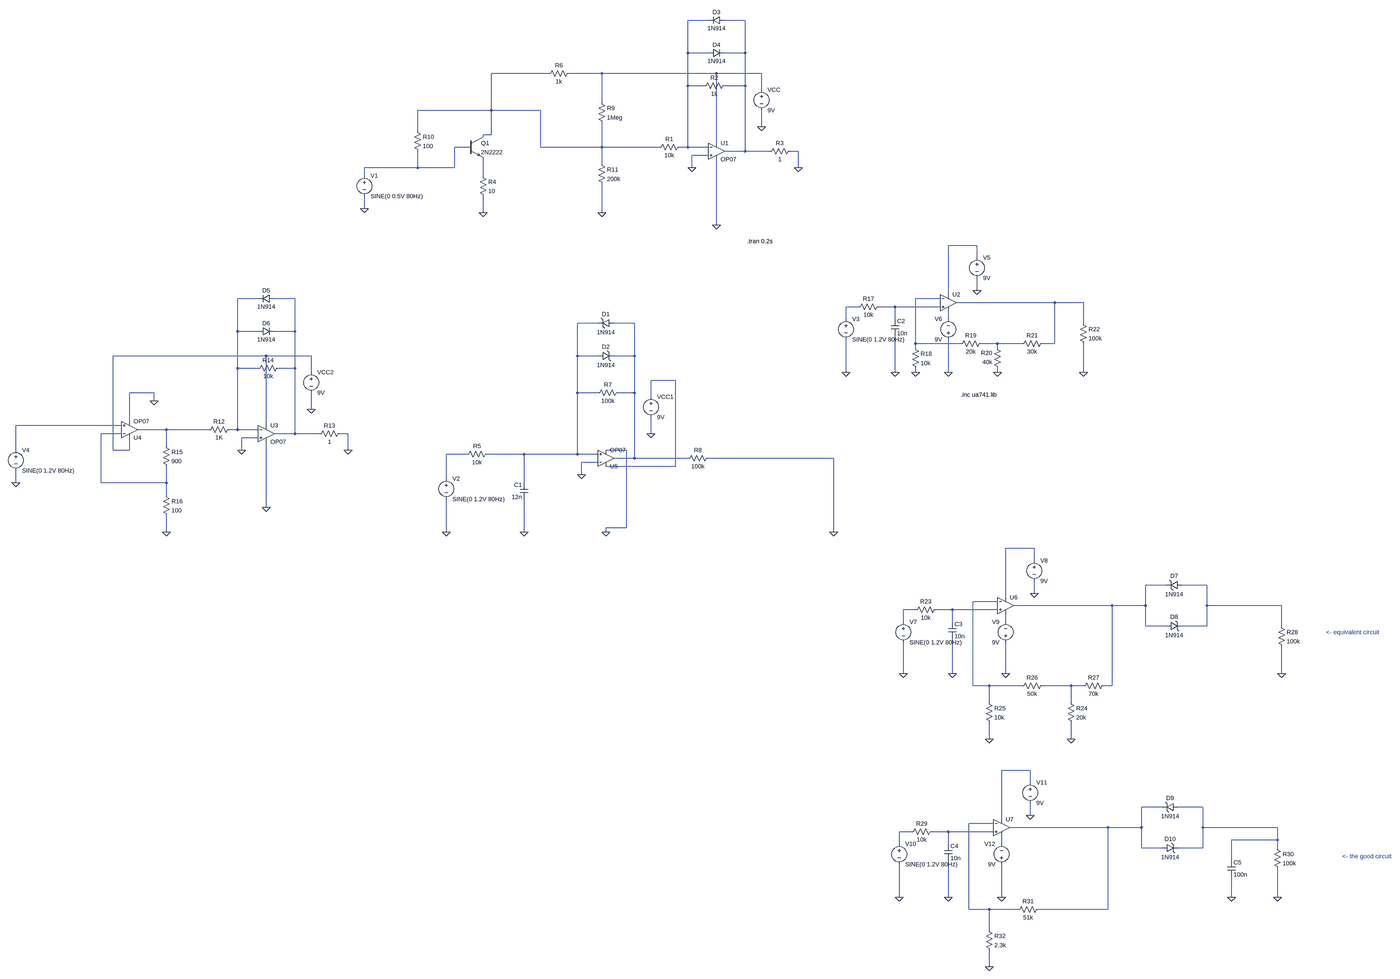
[diagram p0: schematic triggerSchmittFuzz-trialAndError.asc, whole sheet]
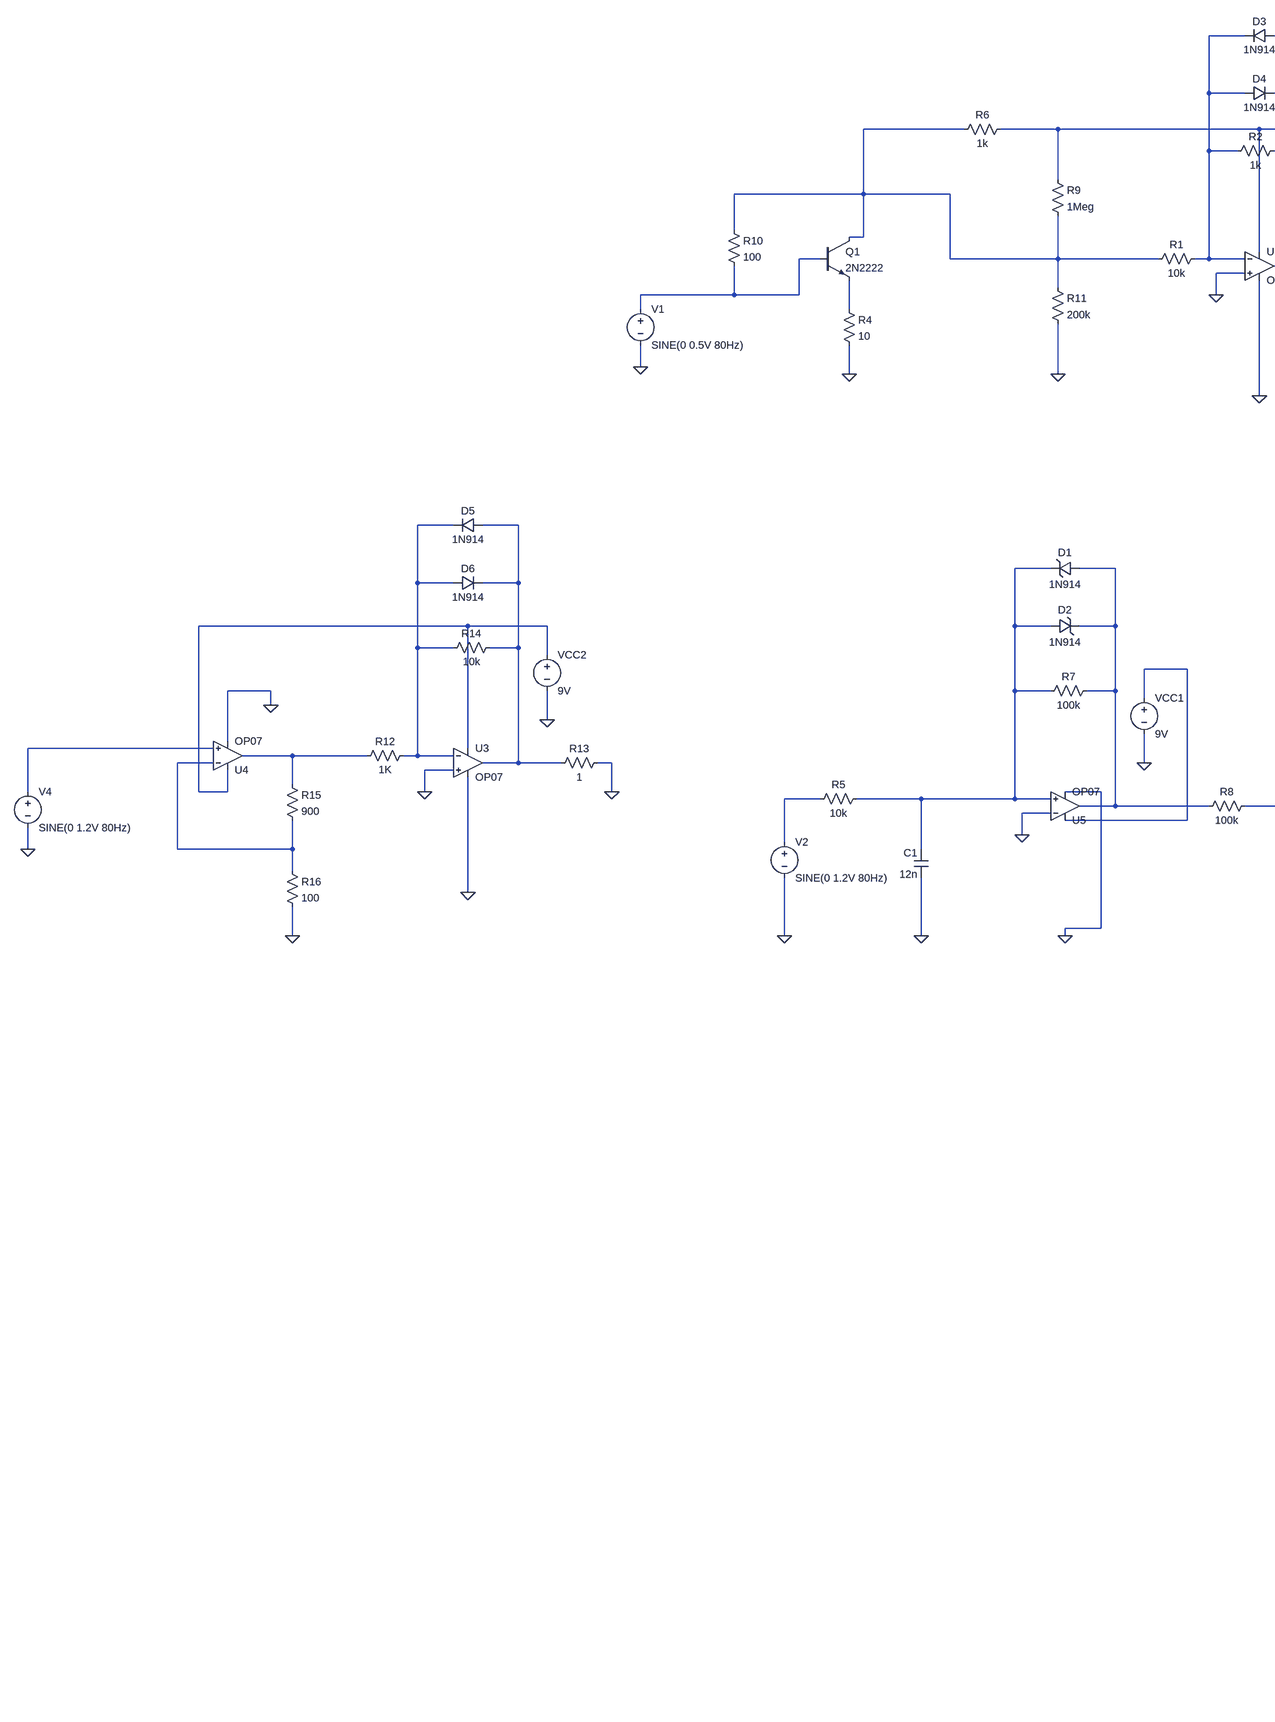
[diagram p1: schematic triggerSchmittFuzz-trialAndError.asc, part, row 1 of 1, column 1 of 2]
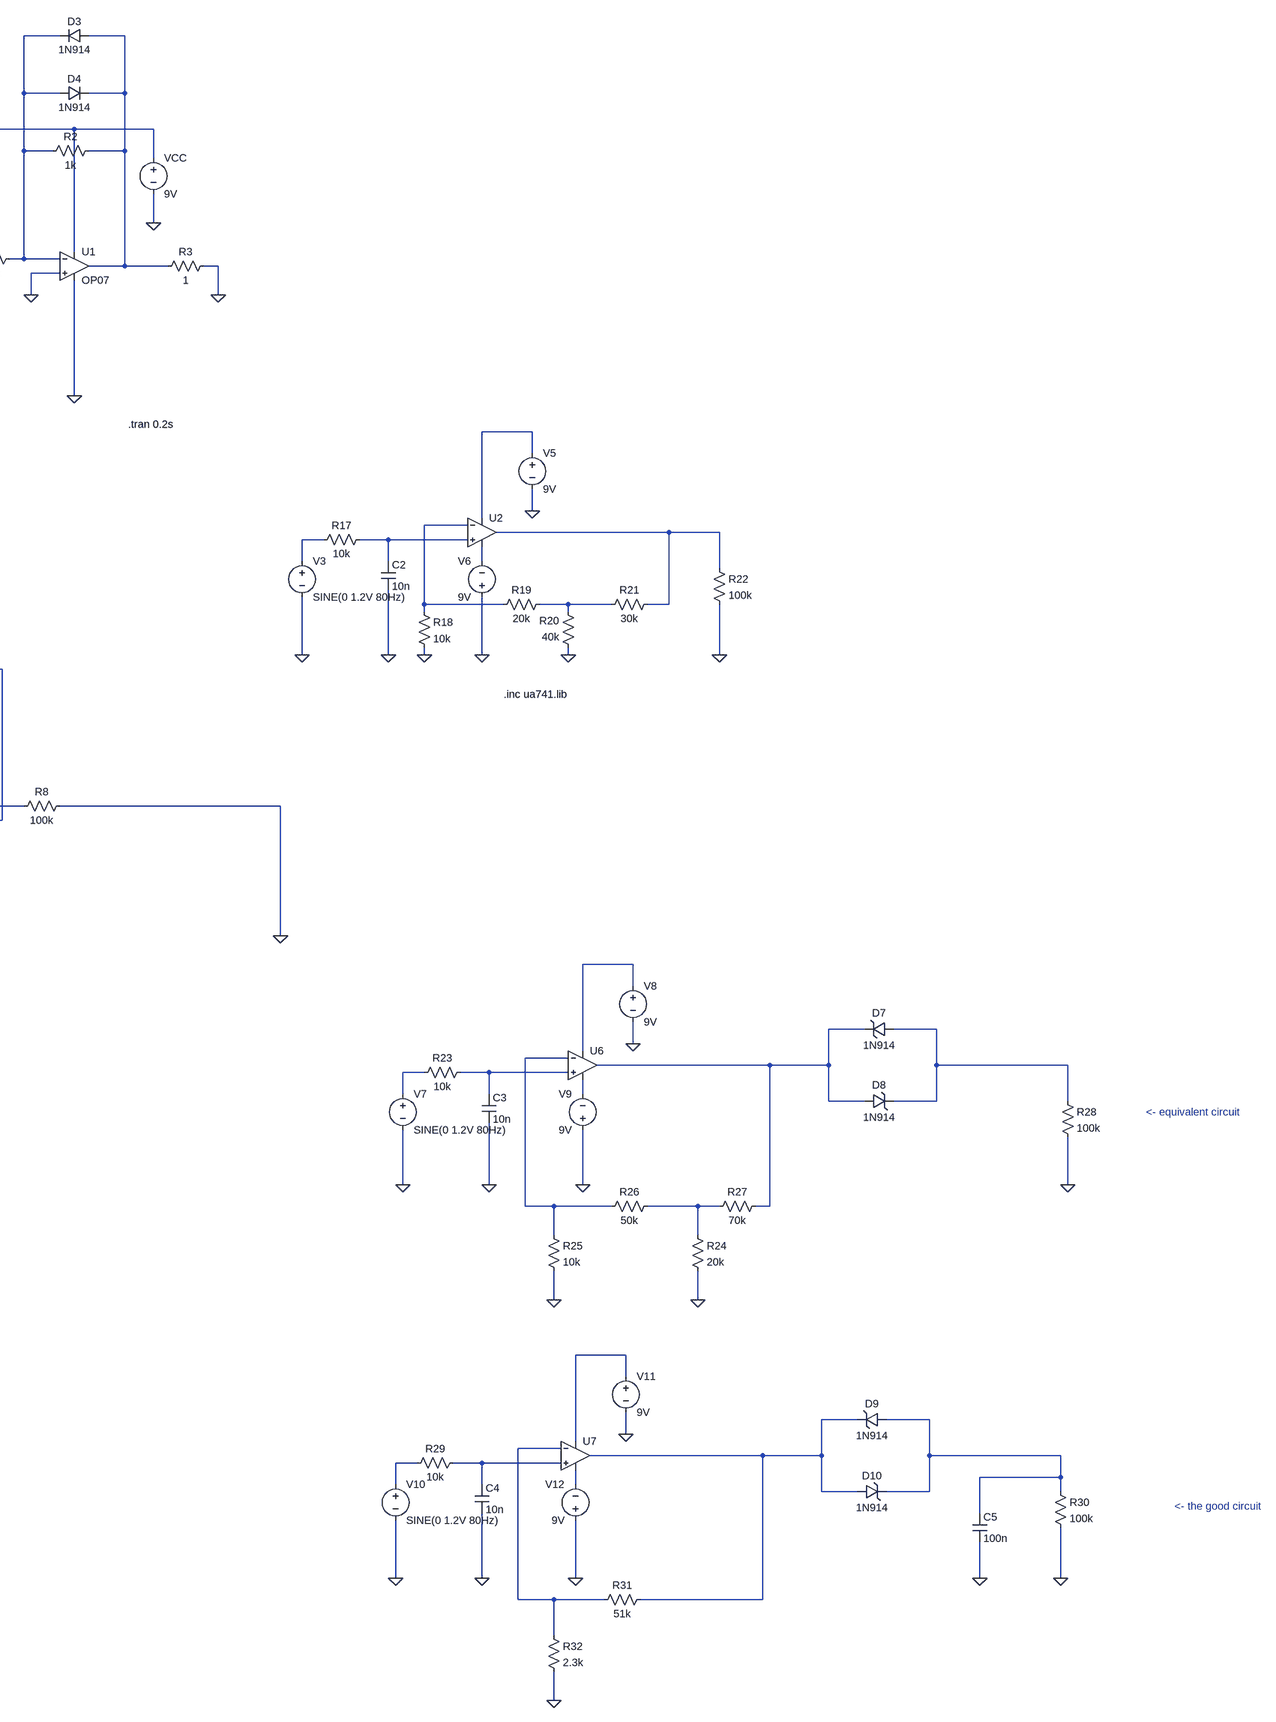
[diagram p2: schematic triggerSchmittFuzz-trialAndError.asc, part, row 1 of 1, column 2 of 2]
triggerSchmittFuzz-trialAndError.asc, the LTspice schematic file:
Version 4.1
SHEET 1 2932 3348
WIRE -32 -400 -112 -400
WIRE 112 -400 32 -400
WIRE -112 -272 -112 -400
WIRE -32 -272 -112 -272
WIRE 112 -272 112 -400
WIRE 112 -272 32 -272
WIRE -656 -192 -880 -192
WIRE -448 -192 -576 -192
WIRE 0 -192 -448 -192
WIRE 176 -192 0 -192
WIRE -112 -144 -112 -272
WIRE -48 -144 -112 -144
WIRE 112 -144 112 -272
WIRE 112 -144 32 -144
WIRE 176 -128 176 -192
WIRE -448 -80 -448 -192
WIRE -880 -48 -880 -192
WIRE -880 -48 -1168 -48
WIRE -688 -48 -880 -48
WIRE 176 16 176 -48
WIRE -1168 32 -1168 -48
WIRE -880 48 -880 -48
WIRE -880 48 -912 48
WIRE 0 80 0 -192
WIRE -976 96 -1024 96
WIRE -688 96 -688 -48
WIRE -448 96 -448 0
WIRE -448 96 -688 96
WIRE -224 96 -448 96
WIRE -112 96 -112 -144
WIRE -112 96 -144 96
WIRE -32 96 -112 96
WIRE 112 112 112 -144
WIRE 112 112 32 112
WIRE 208 112 112 112
WIRE 320 112 288 112
WIRE -32 128 -96 128
WIRE -448 160 -448 96
WIRE -1168 176 -1168 112
WIRE -1168 176 -1376 176
WIRE -1024 176 -1024 96
WIRE -1024 176 -1168 176
WIRE -96 176 -96 128
WIRE 320 176 320 112
WIRE -1376 208 -1376 176
WIRE -912 208 -912 144
WIRE -1376 336 -1376 288
WIRE -912 352 -912 288
WIRE -448 352 -448 240
WIRE 0 400 0 144
WIRE 1040 480 928 480
WIRE 1040 528 1040 480
WIRE 1040 656 1040 608
WIRE 928 672 928 480
WIRE -1792 688 -1872 688
WIRE -1648 688 -1728 688
WIRE 896 688 800 688
WIRE 1344 704 960 704
WIRE 1456 704 1344 704
WIRE 576 720 528 720
WIRE 720 720 656 720
WIRE 896 720 720 720
WIRE 528 768 528 720
WIRE 720 768 720 720
WIRE 928 768 928 736
WIRE -464 784 -544 784
WIRE -320 784 -400 784
WIRE 1456 784 1456 704
WIRE -1872 816 -1872 688
WIRE -1792 816 -1872 816
WIRE -1648 816 -1648 688
WIRE -1648 816 -1728 816
WIRE 800 864 800 688
WIRE 976 864 800 864
WIRE 1120 864 1056 864
WIRE 1216 864 1120 864
WIRE 1344 864 1344 704
WIRE 1344 864 1296 864
WIRE 800 880 800 864
WIRE 1120 880 1120 864
WIRE -1760 912 -2560 912
WIRE -1584 912 -1760 912
WIRE -544 912 -544 784
WIRE -464 912 -544 912
WIRE -320 912 -320 784
WIRE -320 912 -400 912
WIRE -1872 960 -1872 816
WIRE -1792 960 -1872 960
WIRE -1648 960 -1648 816
WIRE -1648 960 -1712 960
WIRE -1584 976 -1584 912
WIRE 528 976 528 848
WIRE 720 976 720 832
WIRE 800 976 800 960
WIRE 928 976 928 848
WIRE 1120 976 1120 960
WIRE 1456 976 1456 864
WIRE -160 1008 -256 1008
WIRE -2400 1056 -2496 1056
WIRE -544 1056 -544 912
WIRE -464 1056 -544 1056
WIRE -320 1056 -320 912
WIRE -320 1056 -384 1056
WIRE -256 1072 -256 1008
WIRE -2400 1088 -2400 1056
WIRE -1584 1120 -1584 1056
WIRE -2496 1168 -2496 1056
WIRE -2528 1184 -3072 1184
WIRE -1760 1184 -1760 912
WIRE -2352 1200 -2464 1200
WIRE -1984 1200 -2352 1200
WIRE -1872 1200 -1872 960
WIRE -1872 1200 -1904 1200
WIRE -1792 1200 -1872 1200
WIRE -2528 1216 -2608 1216
WIRE -1648 1216 -1648 960
WIRE -1648 1216 -1728 1216
WIRE -1552 1216 -1648 1216
WIRE -1440 1216 -1472 1216
WIRE -256 1216 -256 1152
WIRE -1792 1232 -1856 1232
WIRE -2352 1264 -2352 1200
WIRE -3072 1280 -3072 1184
WIRE -2560 1280 -2560 912
WIRE -2496 1280 -2496 1232
WIRE -2496 1280 -2560 1280
WIRE -1856 1280 -1856 1232
WIRE -1440 1280 -1440 1216
WIRE -352 1280 -432 1280
WIRE -976 1296 -1056 1296
WIRE -752 1296 -896 1296
WIRE -544 1296 -544 1056
WIRE -544 1296 -752 1296
WIRE -464 1296 -544 1296
WIRE -320 1312 -320 1056
WIRE -320 1312 -400 1312
WIRE -112 1312 -320 1312
WIRE 480 1312 -32 1312
WIRE -464 1328 -528 1328
WIRE -160 1344 -160 1008
WIRE -160 1344 -432 1344
WIRE -528 1376 -528 1328
WIRE -1056 1392 -1056 1296
WIRE -3072 1408 -3072 1360
WIRE -2608 1408 -2608 1216
WIRE -2352 1408 -2352 1344
WIRE -2352 1408 -2608 1408
WIRE -752 1408 -752 1296
WIRE -2352 1456 -2352 1408
WIRE -1760 1504 -1760 1248
WIRE -352 1584 -352 1280
WIRE -352 1584 -432 1584
WIRE -2352 1600 -2352 1536
WIRE -1056 1600 -1056 1472
WIRE -752 1600 -752 1472
WIRE -432 1600 -432 1584
WIRE 480 1600 480 1312
WIRE 1264 1664 1152 1664
WIRE 1264 1712 1264 1664
WIRE 1904 1808 1824 1808
WIRE 2064 1808 1968 1808
WIRE 1264 1840 1264 1792
WIRE 1152 1856 1152 1664
WIRE 1120 1872 1024 1872
WIRE 1568 1888 1184 1888
WIRE 1824 1888 1824 1808
WIRE 1824 1888 1568 1888
WIRE 2064 1888 2064 1808
WIRE 2384 1888 2064 1888
WIRE 800 1904 752 1904
WIRE 944 1904 880 1904
WIRE 1120 1904 944 1904
WIRE 752 1952 752 1904
WIRE 944 1952 944 1904
WIRE 1152 1952 1152 1920
WIRE 1824 1968 1824 1888
WIRE 1904 1968 1824 1968
WIRE 2064 1968 2064 1888
WIRE 2064 1968 1968 1968
WIRE 2384 1968 2384 1888
WIRE 752 2160 752 2032
WIRE 944 2160 944 2016
WIRE 1152 2160 1152 2032
WIRE 2384 2160 2384 2048
WIRE 1024 2208 1024 1872
WIRE 1088 2208 1024 2208
WIRE 1216 2208 1088 2208
WIRE 1408 2208 1296 2208
WIRE 1456 2208 1408 2208
WIRE 1568 2208 1568 1888
WIRE 1568 2208 1536 2208
WIRE 1088 2272 1088 2208
WIRE 1408 2272 1408 2208
WIRE 1088 2416 1088 2352
WIRE 1408 2416 1408 2352
WIRE 1248 2560 1136 2560
WIRE 1248 2608 1248 2560
WIRE 1888 2704 1808 2704
WIRE 2048 2704 1952 2704
WIRE 1248 2736 1248 2688
WIRE 1136 2752 1136 2560
WIRE 1104 2768 1008 2768
WIRE 1552 2784 1168 2784
WIRE 1808 2784 1808 2704
WIRE 1808 2784 1552 2784
WIRE 2048 2784 2048 2704
WIRE 2368 2784 2048 2784
WIRE 784 2800 736 2800
WIRE 928 2800 864 2800
WIRE 1104 2800 928 2800
WIRE 2368 2832 2368 2784
WIRE 2368 2832 2160 2832
WIRE 736 2848 736 2800
WIRE 928 2848 928 2800
WIRE 1136 2848 1136 2816
WIRE 1808 2864 1808 2784
WIRE 1888 2864 1808 2864
WIRE 2048 2864 2048 2784
WIRE 2048 2864 1952 2864
WIRE 2368 2864 2368 2832
WIRE 2160 2912 2160 2832
WIRE 736 3056 736 2928
WIRE 928 3056 928 2912
WIRE 1136 3056 1136 2928
WIRE 2160 3056 2160 2976
WIRE 2368 3056 2368 2944
WIRE 1008 3104 1008 2768
WIRE 1088 3104 1008 3104
WIRE 1200 3104 1088 3104
WIRE 1552 3104 1552 2784
WIRE 1552 3104 1280 3104
WIRE 1088 3184 1088 3104
WIRE 1088 3328 1088 3264
FLAG 0 400 0
FLAG 176 16 0
FLAG -96 176 0
FLAG -1376 336 0
FLAG 320 176 0
FLAG -912 352 0
FLAG -432 1600 0
FLAG -256 1216 0
FLAG -528 1376 0
FLAG -448 352 0
FLAG -1760 1504 0
FLAG -1584 1120 0
FLAG -1856 1280 0
FLAG -1440 1280 0
FLAG -3072 1408 0
FLAG -2400 1088 0
FLAG -2352 1600 0
FLAG 480 1600 0
FLAG -1056 1600 0
FLAG -752 1600 0
FLAG 528 976 0
FLAG 720 976 0
FLAG 1040 656 0
FLAG 928 976 0
FLAG 800 976 0
FLAG 1120 976 0
FLAG 1456 976 0
FLAG 752 2160 0
FLAG 944 2160 0
FLAG 1264 1840 0
FLAG 1152 2160 0
FLAG 2384 2160 0
FLAG 1088 2416 0
FLAG 1408 2416 0
FLAG 736 3056 0
FLAG 928 3056 0
FLAG 1248 2736 0
FLAG 1136 3056 0
FLAG 2368 3056 0
FLAG 1088 3328 0
FLAG 2160 3056 0
SYMBOL OpAmps\\OP07 0 48 R0
SYMATTR InstName U1
SYMBOL voltage 176 -144 R0
SYMATTR InstName VCC
SYMATTR Value 9V
SYMBOL voltage -1376 192 R0
WINDOW 123 0 0 Left 0
WINDOW 39 0 0 Left 0
SYMATTR InstName V1
SYMATTR Value SINE(0 0.5V 80Hz)
SYMBOL res -128 80 R90
WINDOW 0 0 56 VBottom 2
WINDOW 3 32 56 VTop 2
SYMATTR InstName R1
SYMATTR Value 10k
SYMBOL res 304 96 R90
WINDOW 0 0 56 VBottom 2
WINDOW 3 32 56 VTop 2
SYMATTR InstName R3
SYMATTR Value 1
SYMBOL npn -976 48 R0
SYMATTR InstName Q1
SYMATTR Value 2N2222
SYMBOL res -928 192 R0
SYMATTR InstName R4
SYMATTR Value 10
SYMBOL res -560 -208 R90
WINDOW 0 0 56 VBottom 2
WINDOW 3 32 56 VTop 2
SYMATTR InstName R6
SYMATTR Value 1k
SYMBOL voltage -256 1056 R0
SYMATTR InstName VCC1
SYMATTR Value 9V
SYMBOL voltage -1056 1376 R0
WINDOW 123 0 0 Left 0
WINDOW 39 0 0 Left 0
SYMATTR InstName V2
SYMATTR Value SINE(0 1.2V 80Hz)
SYMBOL res -368 1040 R90
WINDOW 0 0 56 VBottom 2
WINDOW 3 32 56 VTop 2
SYMATTR InstName R7
SYMATTR Value 100k
SYMBOL diode 32 -416 R90
WINDOW 0 0 32 VBottom 2
WINDOW 3 32 32 VTop 2
SYMATTR InstName D3
SYMATTR Value 1N914
SYMBOL diode -32 -256 R270
WINDOW 0 32 32 VTop 2
WINDOW 3 0 32 VBottom 2
SYMATTR InstName D4
SYMATTR Value 1N914
SYMBOL res 48 -160 R90
WINDOW 0 0 56 VBottom 2
WINDOW 3 32 56 VTop 2
SYMATTR InstName R2
SYMATTR Value 1k
SYMBOL res -1184 16 R0
SYMATTR InstName R10
SYMATTR Value 100
SYMBOL res -464 -96 R0
SYMATTR InstName R9
SYMATTR Value 1Meg
SYMBOL res -464 144 R0
SYMATTR InstName R11
SYMATTR Value 200k
SYMBOL OpAmps\\OP07 -1760 1152 R0
SYMATTR InstName U3
SYMBOL voltage -1584 960 R0
SYMATTR InstName VCC2
SYMATTR Value 9V
SYMBOL res -1888 1184 R90
WINDOW 0 0 56 VBottom 2
WINDOW 3 32 56 VTop 2
SYMATTR InstName R12
SYMATTR Value 1K
SYMBOL res -1456 1200 R90
WINDOW 0 0 56 VBottom 2
WINDOW 3 32 56 VTop 2
SYMATTR InstName R13
SYMATTR Value 1
SYMBOL diode -1728 672 R90
WINDOW 0 0 32 VBottom 2
WINDOW 3 32 32 VTop 2
SYMATTR InstName D5
SYMATTR Value 1N914
SYMBOL diode -1792 832 R270
WINDOW 0 32 32 VTop 2
WINDOW 3 0 32 VBottom 2
SYMATTR InstName D6
SYMATTR Value 1N914
SYMBOL res -1696 944 R90
WINDOW 0 0 56 VBottom 2
WINDOW 3 32 56 VTop 2
SYMATTR InstName R14
SYMATTR Value 10k
SYMBOL voltage -3072 1264 R0
WINDOW 123 0 0 Left 0
WINDOW 39 0 0 Left 0
SYMATTR InstName V4
SYMATTR Value SINE(0 1.2V 80Hz)
SYMBOL OpAmps\\OP07 -2496 1264 M180
SYMATTR InstName U4
SYMBOL res -2368 1248 R0
SYMATTR InstName R15
SYMATTR Value 900
SYMBOL res -2368 1440 R0
SYMATTR InstName R16
SYMATTR Value 100
SYMBOL zener -400 768 R90
WINDOW 0 -4 32 VBottom 2
WINDOW 3 36 32 VTop 2
SYMATTR InstName D1
SYMATTR Value 1N914
SYMBOL zener -464 928 R270
WINDOW 0 36 32 VTop 2
WINDOW 3 -4 32 VBottom 2
SYMATTR InstName D2
SYMATTR Value 1N914
SYMBOL cap -736 1472 R180
WINDOW 0 24 56 Left 2
WINDOW 3 24 8 Left 2
SYMATTR InstName C1
SYMATTR Value 12n
SYMBOL res -880 1280 R90
WINDOW 0 0 56 VBottom 2
WINDOW 3 32 56 VTop 2
SYMATTR InstName R5
SYMATTR Value 10k
SYMBOL OpAmps\\OP07 -432 1376 M180
SYMATTR InstName U5
SYMBOL res -16 1296 R90
WINDOW 0 0 56 VBottom 2
WINDOW 3 32 56 VTop 2
SYMATTR InstName R8
SYMATTR Value 100k
SYMBOL voltage 528 752 R0
WINDOW 123 0 0 Left 0
WINDOW 39 0 0 Left 0
SYMATTR InstName V3
SYMATTR Value SINE(0 1.2V 80Hz)
SYMBOL cap 704 768 R0
SYMATTR InstName C2
SYMATTR Value 10n
SYMBOL voltage 1040 512 R0
SYMATTR InstName V5
SYMATTR Value 9V
SYMBOL voltage 928 864 R180
WINDOW 0 24 96 Left 2
WINDOW 3 24 16 Left 2
SYMATTR InstName V6
SYMATTR Value 9V
SYMBOL OpAmps\\UniversalOpAmp2 928 704 R0
SYMATTR InstName U2
SYMBOL res 672 704 R90
WINDOW 0 0 56 VBottom 2
WINDOW 3 32 56 VTop 2
SYMATTR InstName R17
SYMATTR Value 10k
SYMBOL res 784 864 R0
SYMATTR InstName R18
SYMATTR Value 10k
SYMBOL res 1072 848 R90
WINDOW 0 0 56 VBottom 2
WINDOW 3 32 56 VTop 2
SYMATTR InstName R19
SYMATTR Value 20k
SYMBOL res 1136 976 R180
WINDOW 0 36 76 Left 2
WINDOW 3 36 40 Left 2
SYMATTR InstName R20
SYMATTR Value 40k
SYMBOL res 1200 880 R270
WINDOW 0 32 56 VTop 2
WINDOW 3 0 56 VBottom 2
SYMATTR InstName R21
SYMATTR Value 30k
SYMBOL res 1440 768 R0
SYMATTR InstName R22
SYMATTR Value 100k
SYMBOL voltage 752 1936 R0
WINDOW 123 0 0 Left 0
WINDOW 39 0 0 Left 0
SYMATTR InstName V7
SYMATTR Value SINE(0 1.2V 80Hz)
SYMBOL cap 928 1952 R0
SYMATTR InstName C3
SYMATTR Value 10n
SYMBOL voltage 1264 1696 R0
SYMATTR InstName V8
SYMATTR Value 9V
SYMBOL voltage 1152 2048 R180
WINDOW 0 24 96 Left 2
WINDOW 3 24 16 Left 2
SYMATTR InstName V9
SYMATTR Value 9V
SYMBOL OpAmps\\UniversalOpAmp2 1152 1888 R0
SYMATTR InstName U6
SYMBOL res 896 1888 R90
WINDOW 0 0 56 VBottom 2
WINDOW 3 32 56 VTop 2
SYMATTR InstName R23
SYMATTR Value 10k
SYMBOL res 2368 1952 R0
SYMATTR InstName R28
SYMATTR Value 100k
SYMBOL res 1312 2192 R90
WINDOW 0 0 56 VBottom 2
WINDOW 3 32 56 VTop 2
SYMATTR InstName R26
SYMATTR Value 50k
SYMBOL zener 1968 1792 R90
WINDOW 0 -4 32 VBottom 2
WINDOW 3 36 32 VTop 2
SYMATTR InstName D7
SYMATTR Value 1N914
SYMBOL zener 1904 1984 R270
WINDOW 0 36 32 VTop 2
WINDOW 3 -4 32 VBottom 2
SYMATTR InstName D8
SYMATTR Value 1N914
SYMBOL res 1392 2256 R0
SYMATTR InstName R24
SYMATTR Value 20k
SYMBOL res 1072 2256 R0
SYMATTR InstName R25
SYMATTR Value 10k
SYMBOL res 1552 2192 R90
WINDOW 0 0 56 VBottom 2
WINDOW 3 32 56 VTop 2
SYMATTR InstName R27
SYMATTR Value 70k
SYMBOL voltage 736 2832 R0
WINDOW 123 0 0 Left 0
WINDOW 39 0 0 Left 0
SYMATTR InstName V10
SYMATTR Value SINE(0 1.2V 80Hz)
SYMBOL cap 912 2848 R0
SYMATTR InstName C4
SYMATTR Value 10n
SYMBOL voltage 1248 2592 R0
SYMATTR InstName V11
SYMATTR Value 9V
SYMBOL voltage 1136 2944 R180
WINDOW 0 24 96 Left 2
WINDOW 3 24 16 Left 2
SYMATTR InstName V12
SYMATTR Value 9V
SYMBOL OpAmps\\UniversalOpAmp2 1136 2784 R0
SYMATTR InstName U7
SYMBOL res 880 2784 R90
WINDOW 0 0 56 VBottom 2
WINDOW 3 32 56 VTop 2
SYMATTR InstName R29
SYMATTR Value 10k
SYMBOL res 2352 2848 R0
SYMATTR InstName R30
SYMATTR Value 100k
SYMBOL res 1296 3088 R90
WINDOW 0 0 56 VBottom 2
WINDOW 3 32 56 VTop 2
SYMATTR InstName R31
SYMATTR Value 51k
SYMBOL zener 1952 2688 R90
WINDOW 0 -4 32 VBottom 2
WINDOW 3 36 32 VTop 2
SYMATTR InstName D9
SYMATTR Value 1N914
SYMBOL zener 1888 2880 R270
WINDOW 0 36 32 VTop 2
WINDOW 3 -4 32 VBottom 2
SYMATTR InstName D10
SYMATTR Value 1N914
SYMBOL res 1072 3168 R0
SYMATTR InstName R32
SYMATTR Value 2.3k
SYMBOL cap 2144 2912 R0
SYMATTR InstName C5
SYMATTR Value 100n
TEXT 120 464 Left 2 !.tran 0.2s
TEXT 976 1064 Left 2 !.inc ua741.lib
TEXT 2616 1992 Left 2 ;<- equivalent circuit
TEXT 2680 2896 Left 2 ;<- the good circuit

The netlist it stands for:
* triggerSchmittFuzz-trialAndError.asc
X§U1 0 N001 N004 0 N002 LT1001  ; OP07, pins In+ In- V+ V- OUT
VCC N004 0 9V
V1 N005 0 SINE(0 0.5V 80Hz)
R1 N001 N003 10k
R3 0 N002 1
Q1 N003 N005 N006 0 2N2222
R4 N006 0 10
R6 N004 N003 1k
VCC1 N019 0 9V
V2 N023 0 SINE(0 1.2V 80Hz)
R7 N016 N015 100k
D3 N002 N001 1N914
D4 N001 N002 1N914
R2 N002 N001 1k
R10 N003 N005 100
R9 N004 N003 1Meg
R11 N003 0 200k
X§U3 0 N008 N018 0 N009 LT1001  ; OP07, pins In+ In- V+ V- OUT
VCC2 N018 0 9V
R12 N008 N021 1K
R13 0 N009 1
D5 N009 N008 1N914
D6 N008 N009 1N914
R14 N009 N008 10k
V4 N020 0 SINE(0 1.2V 80Hz)
X§U4 N020 N022 N018 0 N021 LT1001  ; OP07, pins In+ In- V+ V- OUT
R15 N021 N022 900
R16 N022 0 100
D1 N016 N015 1N914
D2 N015 N016 1N914
C1 0 N015 12n
R5 N015 N023 10k
X§U5 N015 0 N019 0 N016 LT1001  ; OP07, pins In+ In- V+ V- OUT
R8 0 N016 100k
V3 N012 0 SINE(0 1.2V 80Hz)
C2 N013 0 10n
V5 N007 0 9V
V6 0 N014 9V
X§U2 N013 N010 N007 N014 N011 level2 Avol=1Meg GBW=10Meg Slew=10Meg Ilimit=25m Rail=0 Vos=0 En=0 Enk=0 In=0 Ink=0 Rin=500Meg  ; pins In+ In- V+ V- OUT
R17 N013 N012 10k
R18 N010 0 10k
R19 N017 N010 20k
R20 0 N017 40k
R21 N017 N011 30k
R22 N011 0 100k
V7 N028 0 SINE(0 1.2V 80Hz)
C3 N029 0 10n
V8 N024 0 9V
V9 0 N030 9V
X§U6 N029 N027 N024 N030 N025 level2 Avol=1Meg GBW=10Meg Slew=10Meg Ilimit=25m Rail=0 Vos=0 En=0 Enk=0 In=0 Ink=0 Rin=500Meg  ; pins In+ In- V+ V- OUT
R23 N029 N028 10k
R28 N026 0 100k
R26 N031 N027 50k
D7 N026 N025 1N914
D8 N025 N026 1N914
R24 N031 0 20k
R25 N027 0 10k
R27 N025 N031 70k
V10 N036 0 SINE(0 1.2V 80Hz)
C4 N037 0 10n
V11 N032 0 9V
V12 0 N038 9V
X§U7 N037 N035 N032 N038 N033 level2 Avol=1Meg GBW=10Meg Slew=10Meg Ilimit=25m Rail=0 Vos=0 En=0 Enk=0 In=0 Ink=0 Rin=500Meg  ; pins In+ In- V+ V- OUT
R29 N037 N036 10k
R30 N034 0 100k
R31 N033 N035 51k
D9 N034 N033 1N914
D10 N033 N034 1N914
R32 N035 0 2.3k
C5 N034 0 100n
.model D D
.lib standard.dio
.model NPN NPN
.model PNP PNP
.lib standard.bjt
.tran 0.2s
.inc ua741.lib
* <- equivalent circuit
* <- the good circuit
.lib LTC.lib
.lib UniversalOpAmp2.lib
.backanno
.end